# EAGLE design mag3110 (EAGLE 7.3.0)
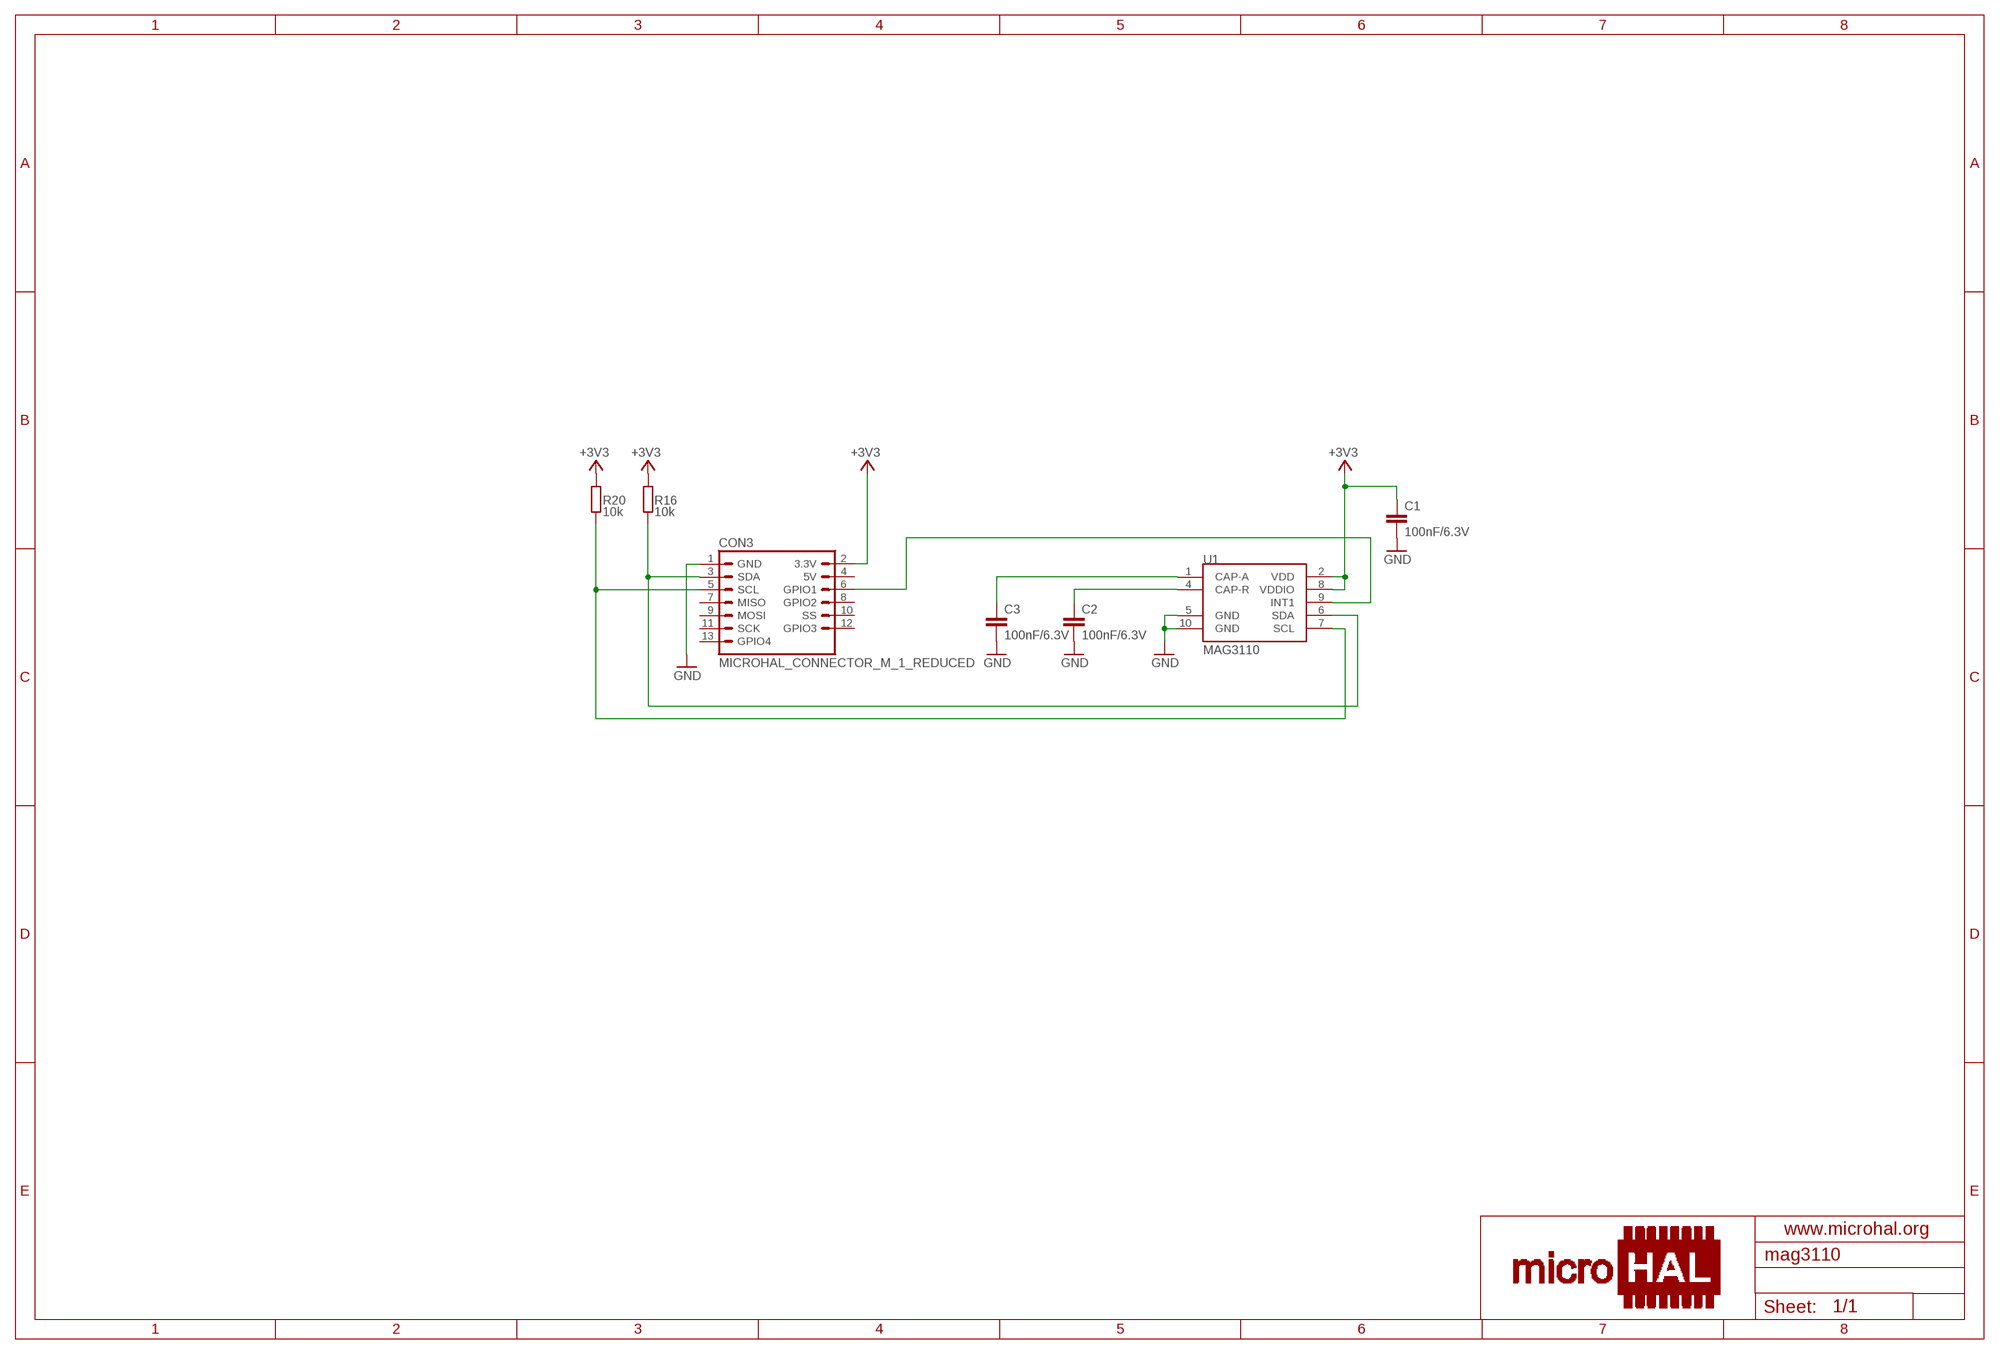
[diagram p0: schematic, sheet 1]

## Parts
C1  100nF/6.3V  C-EUC0603K  [C0603K]
C2  100nF/6.3V  C-EUC0603K  [C0603K]
C3  100nF/6.3V  C-EUC0603K  [C0603K]
CON3  MICROHAL_CONNECTOR_M_1_REDUCED  [MICROHAL_CONNECTOR_M_1_REDUCED_EDGE]
R16  10k  R-EU_R0603  [R0603]
R20  10k  R-EU_R0603  [R0603]
U1  MAG3110  [DFN-10]

## Nets
+3V3: C1.1 CON3.2(3.3V) R16.2 R20.2 U1.2(VDD) U1.8(VDDIO)
GND: C1.2 C2.2 C3.2 CON3.1(GND) U1.5(GND) U1.10(GND)
N$2: C2.1 U1.4(CAP-R)
N$3: CON3.3(SDA) R16.1 U1.6(SDA)
N$4: CON3.5(SCL) R20.1 U1.7(SCL)
N$5: CON3.6(GPIO1) U1.9(INT1)
N$6: C3.1 U1.1(CAP-A)
Unconnected: CON3.4(5V) CON3.7(MISO) CON3.8(GPIO2) CON3.9(MOSI) CON3.10(SS) CON3.11(SCK) CON3.12(GPIO3) CON3.13(GPIO4)

## Library data of the parts
C1-C3 = rcl:C-EU: CAPACITOR, European symbol
CON3 = microhal-connector_v2:MICROHAL_CONNECTOR_M_1_REDUCED
R16 R20 = rcl:R-EU_: RESISTOR, European symbol
U1 = mag3110:MAG3110: 3-axis digital magnetometer

## Board
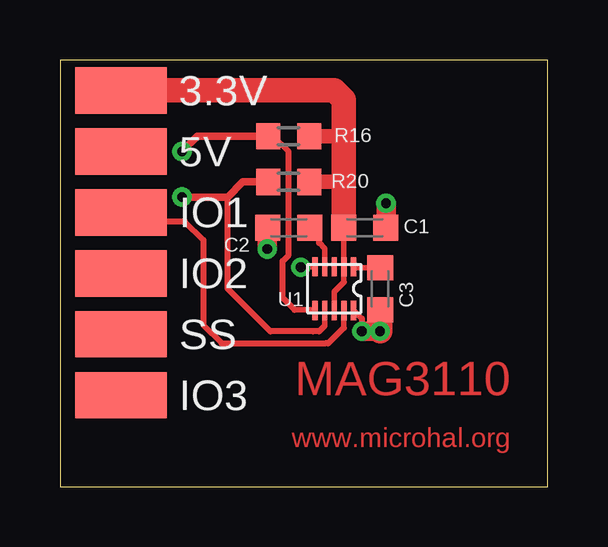
[diagram p1: board, top side]
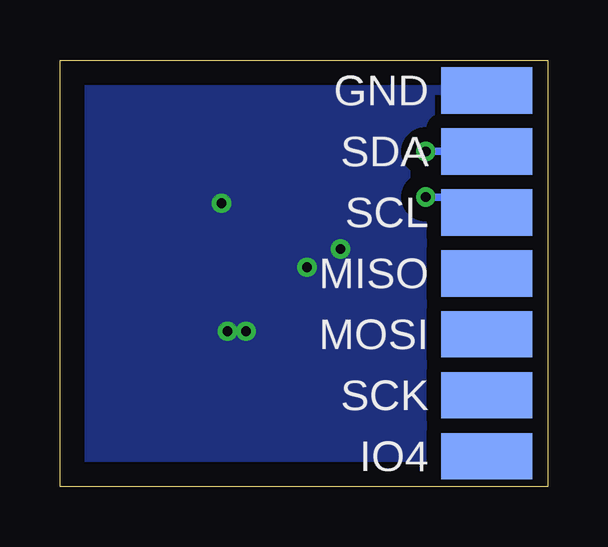
[diagram p2: board, bottom side, seen from below]

Size 20.32 x 17.78 mm. Coordinates in mm from the lower left corner, seen from the top.
Outline: 0,0 20.32,0 20.32,17.78 0,17.78 0,0
Copper layers (1*16): Top 0.035mm / dielectric 1.5mm / Bottom 0.035mm
Design rules "default *": minimum track width 10mil, minimum drill 14mil, track to track 8mil, track to pad 8mil, pad to pad 8mil, via to via 8mil, smd to smd 4mil, copper to edge 40mil, drill to drill 8mil, minimum pad ring 10mil, minimum via ring 8mil, stop-mask expansion 4mil, vias tented up to drill 0mil, thermal gap 10mil

### Footprints (pad centres in the part's own frame; a part is rotated, then mirrored left to right if it is on the bottom)
C0603K = smd 1.05 x 1.08: 1 -0.875,0; 2 0.875,0
MICROHAL_CONNECTOR_M_1_REDUCED_EDGE = smd 1.93 x 3.81 bottom: 1 -7.62,0; 3 -5.08,0; 5 -2.54,0; 7 0,0; 9 2.54,0; 11 5.08,0; 13 7.62,0 | smd 1.93 x 3.81: 2 -7.62,0; 4 -5.08,0; 6 -2.54,0; 8 0,0; 10 2.54,0; 12 5.08,0
R0603 = smd 1 x 1.1: 1 -0.85,0; 2 0.85,0
DFN-10 = smd 0.8 x 0.22: 1 -0.91,0.8; 2 -0.91,0.4; 3 -0.91,0; 4 -0.91,-0.4; 5 -0.91,-0.8; 6 0.91,-0.8; 7 0.91,-0.4; 8 0.91,0; 9 0.91,0.4; 10 0.91,0.8

### Placement (x,y rotation side)
C1  12.7,10.79 0 top
C2  9.53,10.79 180 top
C3  13.34,8.26 270 top
CON3  2.54,8.89 270 top
R16  9.53,14.61 0 top
R20  9.53,12.7 0 top
U1  11.43,8.26 270 top

### Tracks (layer width: path | path; a pad name or v marks a point on that pad's centre or on a via)
+3V3
  Top 0.229: C1.1 U1.2 11.83,8.53 | U1.8 11.43,8.13
  Top 0.254: 11.43,8.13 11.83,8.53
  Top 0.61: R16.2 11.82,14.61 | R20.2 11.82,12.7
  Top 1.016: CON3.2 11.43,16.51 11.82,16.11 11.82,14.61 11.82,12.7 C1.1
GND  (via drill 0.4)
  Top 0.229: U1.5 10.03,9.16 v10.03,9.14 | U1.10 12.57,7
  Top 0.254: 12.57,7 v12.57,6.48
  Top 0.813: C1.2 13.59,10.81 v13.59,11.81 | C2.2 8.64,10.81 v8.64,9.91 | v12.57,6.48 v13.34,6.48
  Top 1.016: C3.2 v13.34,6.48
  pour Bottom (isolate 0.61): 0,17.78 20.32,17.78 20.32,0 0,0
N$2
  Top 0.229: U1.4 11.03,9.93
  Top 0.254: 11.03,9.93 10.79,10.16 10.79,10.4 C2.1
N$3  (via drill 0.4)
  Top 0.229: U1.6 10.61,7.37 9.78,7.37
  Top 0.254: 9.78,7.37 9.27,7.87 9.27,9.4 9.53,9.65 9.53,13.97 8.89,14.61 R16.1
  Top 0.305: R16.1 5.71,14.61 v5.08,13.97
  Bottom 0.305: v5.08,13.97 CON3.3
N$4  (via drill 0.4)
  Top 0.229: U1.7 11.03,6.71
  Top 0.254: 11.03,6.71 10.79,6.48 10.54,6.48 8.76,6.48 6.99,8.26 6.99,12.06
  Top 0.305: R20.1 7.62,12.7 6.99,12.06 v5.08,12.06
  Bottom 0.305: v5.08,12.06 3.17,12.06 CON3.5
N$5
  Top 0.229: U1.9 11.83,6.62
  Top 0.254: 11.83,6.62 11.18,5.97 11.05,5.97 6.73,5.97 5.97,6.73 5.97,10.29 5.21,11.05 2.92,11.05 CON3.6
N$6
  Top 0.229: U1.1 12.27,9.13 C3.1

### Text on the board
Top: MAG3110 | www.microhal.org
tStop: MAG3110 | www.microhal.org
tDocu: v1.0